# Altium project Battery_Monitor_4Cell.PrjPcb
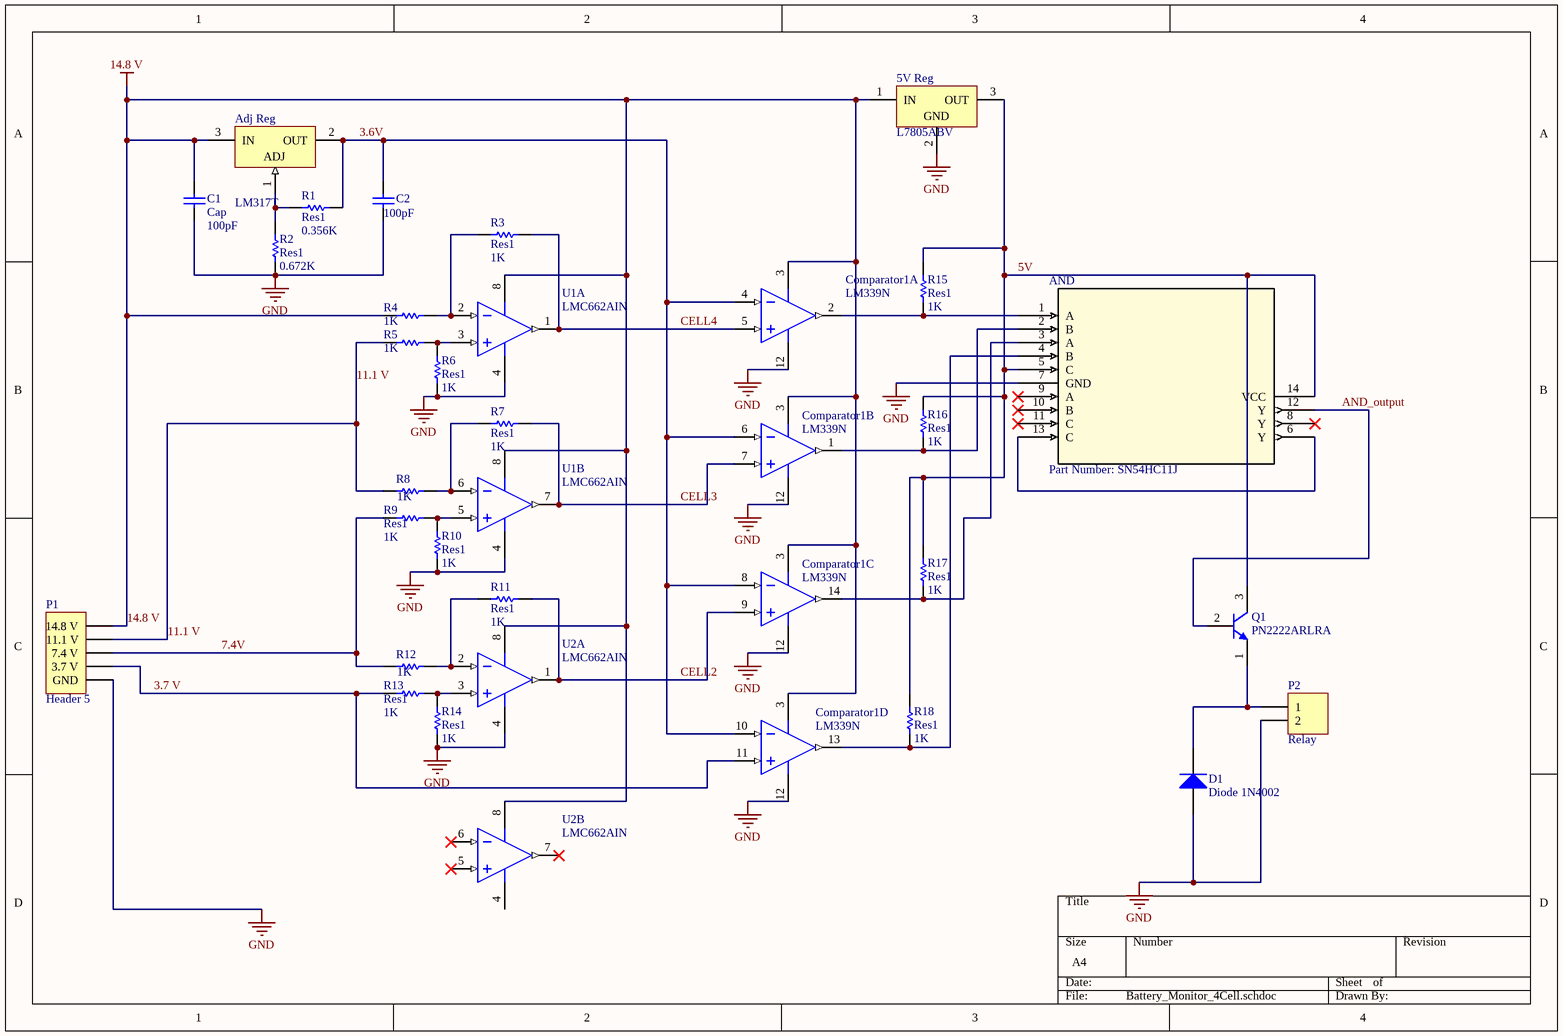
[diagram p0: Battery_Monitor_4Cell.schdoc]
1 sheet, 30 parts. Net scope: global (net labels, ports and power ports of the same name join across sheets).
Board file: Battery_Monitor_4Cell.pcbdoc

## Sheet Battery_Monitor_4Cell.schdoc
size A4

### Parts
5V_Reg  L7805ABV  [TO220]
Adj_Reg  LM317T  [TO-220]
AND  Part Number: SN54HC11J  [J14]
C1  Cap  value 100pF  [RAD-0.3]
C2  value 100pF  [RAD-0.3]  (hidden comment: Cap)
Comparator1  LM339N  [N14A]  (parts A,B,C,D of 4)
D1  Diode 1N4002  [DO-41]
P1  Header 5  [HDR1X5]
P2  Relay  [HDR1X2]
Q1  PN2222ARLRA  [ONSC-TO-92-3-29-11_AM_BL]
R1  Res1  value 0.356K  [AXIAL-0.3]
R2  Res1  value 0.672K  [AXIAL-0.3]
R3  Res1  value 1K  [AXIAL-0.3]
R4  value 1K  [AXIAL-0.3]  (hidden comment: Res1)
R5  value 1K  [AXIAL-0.3]  (hidden comment: Res1)
R6  Res1  value 1K  [AXIAL-0.3]
R7  Res1  value 1K  [AXIAL-0.3]
R8  value 1K  [AXIAL-0.3]  (hidden comment: Res1)
R9  Res1  value 1K  [AXIAL-0.3]
R10  Res1  value 1K  [AXIAL-0.3]
R11  Res1  value 1K  [AXIAL-0.3]
R12  value 1K  [AXIAL-0.3]  (hidden comment: Res1)
R13  Res1  value 1K  [AXIAL-0.3]
R14  Res1  value 1K  [AXIAL-0.3]
R15  Res1  value 1K  [AXIAL-0.3]
R16  Res1  value 1K  [AXIAL-0.3]
R17  Res1  value 1K  [AXIAL-0.3]
R18  Res1  value 1K  [AXIAL-0.3]
U1  LMC662AIN  [N08E]  (parts A,B of 2)
U2  LMC662AIN  [N08E]  (parts A,B of 2)

### Nets
14.8 V: 5V_Reg.1(IN) Adj_Reg.3(IN) C1.2 Comparator1.3(V+) P1.5(14.8_V) R4.1 U1.8(V+) U2.8(V+)
GND: 5V_Reg.2(GND) AND.7(GND) C1.1 C2.2 Comparator1.12(GND) D1.1(A) P1.1(GND) P2.2 R2.1 R6.1 R10.1 R14.1 U1.4(V-) U2.4(V-)
3.6V: Adj_Reg.2(OUT) C2.1 Comparator1.4(IN1-) Comparator1.6(IN2-) Comparator1.8(IN3-) Comparator1.10(IN4-) R1.2
3.7 V: Comparator1.11(IN4+) P1.2(3.7_V) R13.1
5V: 5V_Reg.3(OUT) AND.5(C) AND.14(VCC) Q1.3(C) R15.2 R16.2 R17.2 R18.2
7.4V: P1.3(7.4_V) R9.1 R12.1
11.1 V: P1.4(11.1_V) R5.1 R8.1
AND_output: AND.12(Y) Q1.2(B)
CELL2: Comparator1.9(IN3+) R11.2 U2.1(OUTA)
CELL3: Comparator1.7(IN2+) R7.2 U1.7(OUTB)
CELL4: Comparator1.5(IN1+) R3.2 U1.1(OUTA)
NetAdj_Reg_1: Adj_Reg.1(ADJ) R1.1 R2.2
NetAND_1: AND.1(A) Comparator1.2(OUT1) R15.1
NetAND_2: AND.2(B) Comparator1.1(OUT2) R16.1
NetAND_3: AND.3(A) Comparator1.14(OUT3) R17.1
NetAND_4: AND.4(B) Comparator1.13(OUT4) R18.1
NetAND_6: AND.6(Y) AND.13(C)
NetD1_2: D1.2(K) P2.1 Q1.1(E)
NetR3_1: R3.1 R4.2 U1.2(INA-)
NetR5_2: R5.2 R6.2 U1.3(INA+)
NetR7_1: R7.1 R8.2 U1.6(INB-)
NetR9_2: R9.2 R10.2 U1.5(INB+)
NetR11_1: R11.1 R12.2 U2.2(INA-)
NetR13_2: R13.2 R14.2 U2.3(INA+)

Not connected (* = marked no-connect by the designer): AND 8(Y)* 9(A)* 10(B)* 11(C)*; U2 5(INB+)* 6(INB-)* 7(OUTB)*

### Library data of the parts
5V_Reg = L7805ABV: Positive Voltage Regulator, 5V, 3-Pin TO-220; DatasheetVersion: Nov-2011; PackageVersion: ver3.0; PackageReference: TO220; PackageDescription: TO, Thru-Hole, Vertical, Heatsink Mounted; 3 In-Line Leads; Pitch 2.54 mm; PartNumber: L7805ABV; ComponentLink1Description: Manufacturer URL; ComponentLink1URL: http://www.st.com; ComponentLink2Description: Datasheet; ComponentLink2URL: http://www.st.com/internet/com/TECHNICAL_RESOURCES/TECHNICAL_LITERATURE/DATASHEET/CD00000444.pdf; ComponentLink3Description: Package Specification; ComponentLink3URL: http://www.st.com/internet/com/TECHNICAL_RESOURCES/TECHNICAL_LITERATURE/PACKAGE_INFORMATION/CD00004649.pdf
Adj_Reg = LM317T: 1.5A, 1.2V to 37V Adjustable Voltage Regulator, 3-Pin TO-220; DatasheetVersion: Nov-2011; PackageVersion: 2011; PackageReference: TO-220; PackageDescription: TO, Thru-Hole, Vertical, Heatsink Mounted; 3 In-Line Leads; Pitch 2.54 mm; PartNumber: LM317T; ComponentLink1Description: Manufacturer URL; ComponentLink1URL: http://www.st.com; ComponentLink2Description: Datasheet; ComponentLink2URL: http://www.st.com/internet/com/TECHNICAL_RESOURCES/TECHNICAL_LITERATURE/DATASHEET/CD00000455.pdf; ComponentLink3Description: Package Specification; ComponentLink3URL: http://www.st.com/internet/com/TECHNICAL_RESOURCES/TECHNICAL_LITERATURE/PACKAGE_INFORMATION/CD00004649.pdf
AND = SN54HC11J: No Description Available; Vendor: Texas Instruments; Built_By: EMA_UL_Team; Manufacturer_Part_Number: SN54HC11J; Copyright: Copyright (C) 2018 Accelerated Designs. All rights reserved; RefDes: RefDes; Type: DEV; Value: Value
C1 C2 = Cap: Capacitor; Published: 8-Jun-2000; LatestRevisionDate: 17-Jul-2002; LatestRevisionNote: Re-released for DXP Platform.; PackageReference: RAD-0.3; Publisher: Altium Limited; PackageDescription: Radial Cap, Thru-Hole; 2 Leads; 0.3 in Pin Spacing
Comparator1 = LM339N: Low Power Low Offset Voltage Quad Comparator, 14-pin MDIP; Manufacturer: National Semiconductor; PackageTopMarking: NSUZXYYTTE#*LM339N; PowerWise: N; CompType: Amplifiers; High-Reliability: Y; DatasheetVersion: Mar-2004; PackageVersion: revG, May-2006; PackageReference: N14A; PackageDescription: MDIP, .750 x .250 x.130in, 14 Lead, .100in Pitch; PartNumber: LM339N; RoHS: N; PinCount: 14; Code_JEDEC: MS-001-AA; ComponentLink1Description: Manufacturer URL; ComponentLink1URL: http://www.national.com/; ComponentLink2Description: LM339 Datasheet; ComponentLink2URL: http://www.national.com/ds/LM/LM339.pdf; ComponentLink3Description: LM339 Web Page; ComponentLink3URL: http://www.national.com/pf/LM/LM339.html; ComponentLink4Description: N14A Package Page; ComponentLink4URL: http://www.national.com/packaging/folders/n14a.html
D1 = Diode 1N4002: 1 Amp General Purpose Rectifier; Published: 8-Jun-2000; LatestRevisionDate: 17-Jul-2002; LatestRevisionNote: Re-released for DXP Platform.; DatasheetVersion: 1998; PackageVersion: Aug-1999; PackageReference: DO-41; Publisher: Altium Limited; PackageDescription: Diode, Axial; Body 5.2 x 2.7 mm (LxDia. max), Lead Dia. 0.86 mm (max); Code_JEDEC: DO-204-AL; ComponentLink1Description: Manufacturer Link; ComponentLink1URL: http://www.fairchildsemi.com/; ComponentLink2Description: Datasheet; ComponentLink2URL: http://www.fairchildsemi.com/ds/1N%2F1N4001.pdf
P1 = Header 5: Header, 5-Pin; LatestRevisionDate: 17-Jul-2002; LatestRevisionNote: Re-released for DXP Platform.; Publisher: Altium Limited
P2 = Header 2: Header, 2-Pin; LatestRevisionDate: 17-Jul-2002; LatestRevisionNote: Re-released for DXP Platform.; Publisher: Altium Limited
Q1 = PN2222ARLRA: General Purpose Transistor, NPN Silicon, 3-Pin TO-92, Tape and Reel; Manufacturer: On Semiconductor; fT Min (MHz): 300; IC Continuous (A): 0.6; DatasheetVersion: Rev. 5; PackageVersion: Rev. AM; PackageReference: TO-92-3-29-11_AM_BL; PackageDescription: 3-Pin Transistor Outline, Body 4.825 x 3.685 mm, Pitch 1.27 mm; Supplier 1: Digi-Key; Supplier Part Number 1: PN2222ARLRAOSCT-ND; Packing: Tape and Reel; Polarity: NPN; RoHS: FALSE; Mounting Technology: Through Hole; PartNumber: PN2222ARLRA; ComponentLink1Description: Manufacturer URL; ComponentLink1URL: http://www.onsemi.com/; ComponentLink2Description: Datasheet; ComponentLink2URL: http://www.onsemi.com/pub_link/Collateral/PN2222-D.PDF; ComponentLink3Description: Package Specification; ComponentLink3URL: http://www.onsemi.com/pub_link/Collateral/MAC97-D.PDF
R1-R18 = Res1: Resistor; Published: 8-Jun-2000; LatestRevisionDate: 17-Jul-2002; LatestRevisionNote: Re-released for DXP Platform.; PackageReference: AXIAL-0.3; Publisher: Altium Limited; PackageDescription: Axial Device, Thru-Hole; 2 Leads; 0.3 in Pin Spacing
U1 U2 = LMC662AIN: CMOS Dual Operational Amplifier, 8-pin MDIP; Manufacturer: National Semiconductor; PackageTopMarking: NSUZXYTTE#*LMC*662AIN; PowerWise: N; CompType: Amplifiers; High-Reliability: Y; DatasheetVersion: Apr-2003; PackageVersion: revG, May-2006; PackageReference: N08E; PackageDescription: MDIP, .365 x .250 x .130in, 8 Lead, .100in Pitch; PartNumber: LMC662AIN; RoHS: N; PinCount: 8; Code_JEDEC: MS-001-BA; ComponentLink1Description: Manufacturer URL; ComponentLink1URL: http://www.national.com/; ComponentLink2Description: LMC662 Datasheet; ComponentLink2URL: http://www.national.com/ds/LM/LMC662.pdf; ComponentLink3Description: LMC662 Web Page; ComponentLink3URL: http://www.national.com/pf/LM/LMC662.html; ComponentLink4Description: N08E Package Page; ComponentLink4URL: http://www.national.com/packaging/folders/n08e.html